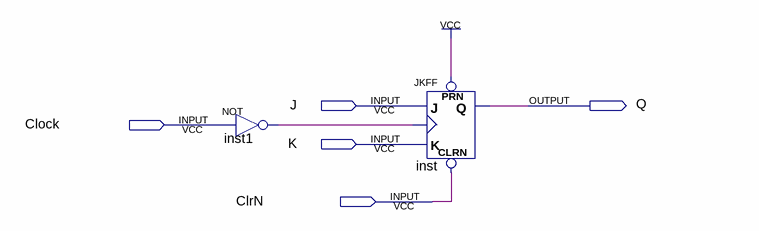
[diagram p0: schematic sheet]
// Quartus schematic jk_ff.bdf as structural Verilog: 2 symbols, 5 pins
module jk_ff (
  input  J,
  input  Clock,
  input  K,
  input  ClrN,
  output Q
);

  wire inst1_out;

  not inst1 (inst1_out, Clock);
  JKFF inst (.PRN(1'b1), .CLRN(ClrN), .K(K), .J(J), .CLK(inst1_out), .Q(Q));
endmodule
